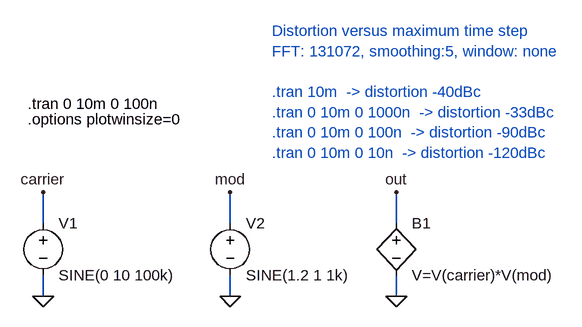
[diagram p0: schematic Fft_Am_Signal.asc]
Fft_Am_Signal.asc, the LTspice schematic file:
Version 4
SHEET 1 880 680
WIRE -48 208 -48 160
WIRE 240 208 240 160
WIRE 496 208 496 160
WIRE -48 320 -48 288
WIRE 240 320 240 288
WIRE 496 320 496 288
FLAG -48 320 0
FLAG 240 320 0
FLAG 496 320 0
FLAG -48 160 carrier
FLAG 240 160 mod
FLAG 496 160 out
SYMBOL voltage -48 192 R0
WINDOW 123 0 0 Left 0
WINDOW 39 0 0 Left 0
SYMATTR InstName V1
SYMATTR Value SINE(0 10 100k)
SYMBOL voltage 240 192 R0
WINDOW 123 0 0 Left 0
WINDOW 39 0 0 Left 0
SYMATTR InstName V2
SYMATTR Value SINE(1.2 1 1k)
SYMBOL bv 496 192 R0
SYMATTR InstName B1
SYMATTR Value V=V(carrier)*V(mod)
TEXT -72 24 Left 0 !.tran 0 10m 0 100n
TEXT -72 48 Left 0 !.options plotwinsize=0
TEXT 304 -88 Left 0 ;Distortion versus maximum time step\nFFT: 131072, smoothing:5, window: none\n \n.tran 10m  -> distortion -40dBc \n.tran 0 10m 0 1000n  -> distortion -33dBc\n.tran 0 10m 0 100n  -> distortion -90dBc\n.tran 0 10m 0 10n  -> distortion -120dBc

The netlist it stands for:
* Fft_Am_Signal.asc
V1 carrier 0 SINE(0 10 100k)
V2 mod 0 SINE(1.2 1 1k)
B1 out 0 V=V(carrier)*V(mod)
.tran 0 10m 0 100n
.options plotwinsize=0
* Distortion versus maximum time step
* FFT: 131072, smoothing:5, window: none
* .tran 10m  -> distortion -40dBc
* .tran 0 10m 0 1000n  -> distortion -33dBc
* .tran 0 10m 0 100n  -> distortion -90dBc
* .tran 0 10m 0 10n  -> distortion -120dBc
.backanno
.end